# EAGLE design LinTempCont_indCh_proto (EAGLE 6.5.0)
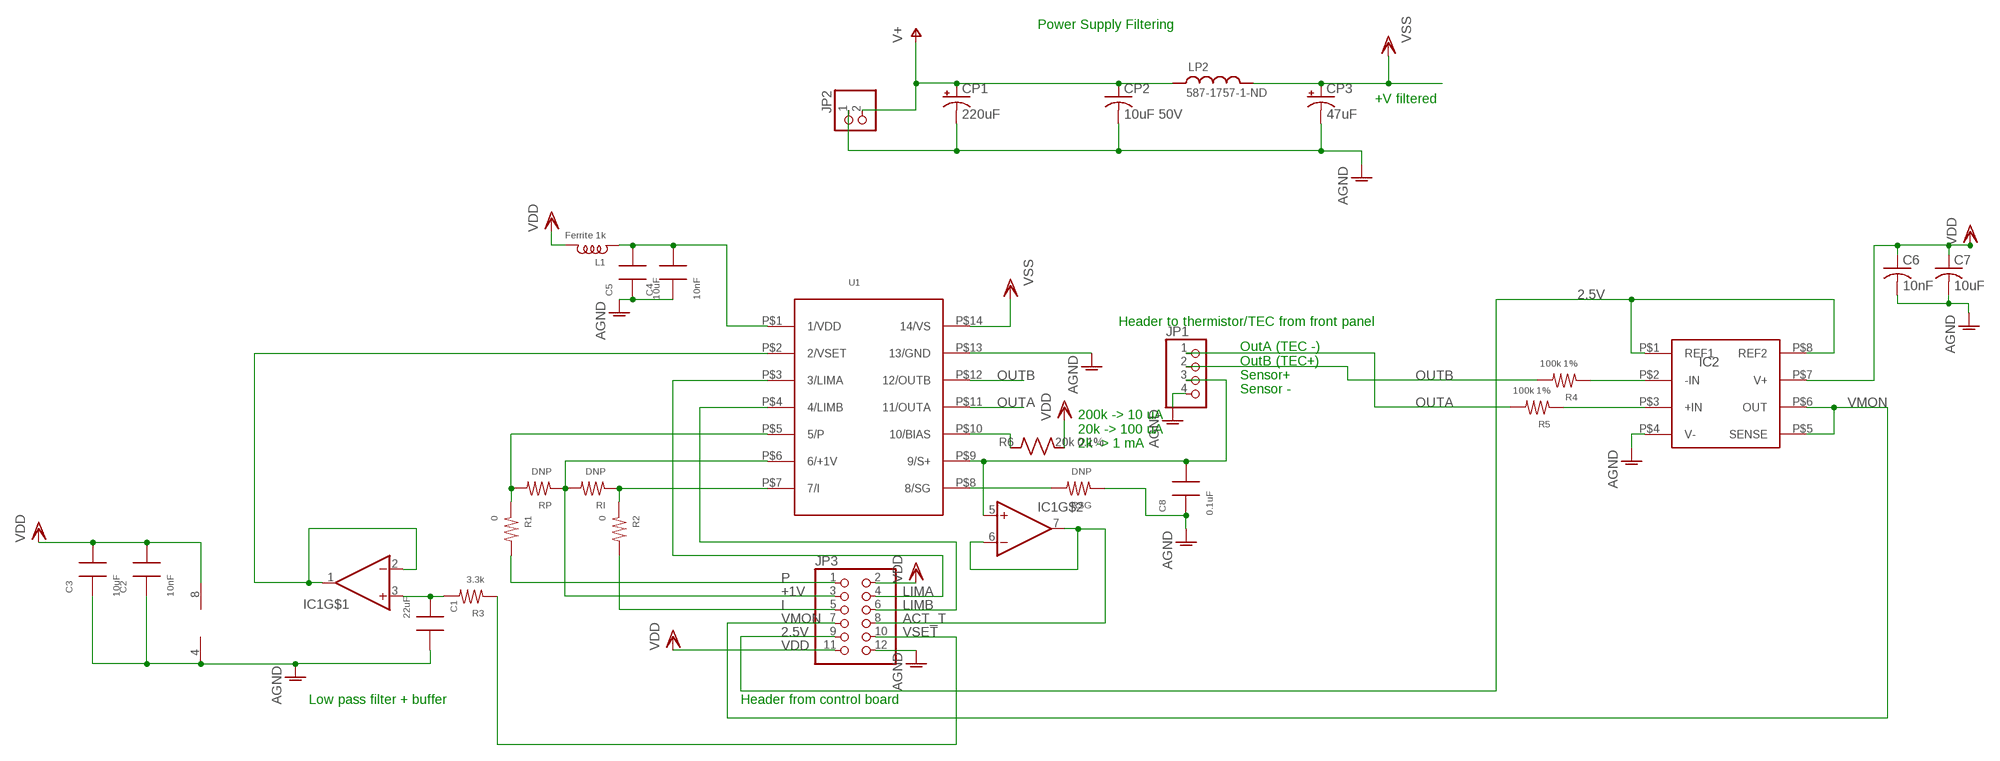
[diagram p0: schematic, sheet 1]

## Parts
C1  22uF  CAP0805  [0805]
C2  10nF  CAP0603  [0603]
C3  10uF  CAP0805  [0805]
C4  10nF  CAP0805  [0805]
C5  10uF  CAP0603  [0603]
C6  10nF  C-USC0603  [C0603]
C7  10uF  C-USC0805  [C0805]
C8  0.1uF  CAP0603  [0603]
CP1  220uF  CPOL-USF  [PANASONIC_F]
CP2  10uF 50V  C-USC1206  [C1206]
CP3  47uF  CPOL-USCT7343  [CT7343]
IC1  OP727  [TSSOP8]
IC2  INA159  [VSSOP8]
JP1  SCRWTRM-1X4/90_ED550  [1X04_RA_SCRWTRM_ED550]
JP2  SCRWTRM-1X2/90_ED550  [1X02_RA_SCRWTRM_ED550]
JP3  PINHD-2X6  [2X06]
L1  Ferrite 1k  INDUCTOR-0805  [0805]
LP2  587-1757-1-ND  L_FERRITE_SMD  [L_FERRITE_1810]
R1  0  RES0603  [0603]
R2  0  RES0603  [0603]
R3  3.3k  RES0603  [0603]
R4  100k 1%  RES0603  [0603]
R5  100k 1%  RES0603  [0603]
R6  20k 0.1%  R_SMDR0805  [R_0805]
RI  DNP  RES0603  [0603]
RP  DNP  RES0603  [0603]
RSG  DNP  RES0603  [0603]
U1  WTC3243  [WTC3293]

## Nets
2.5V: IC2.P$1(REF1) IC2.P$8(REF2) JP3.9
+1V: JP3.3 RI.2 RP.1 U1.P$6(6/+1V)
ACT_T: IC1.6(-IN) IC1.7(OUT) JP3.8
AGND: C1.2 C2.1 C3.1 C4.1 C5.1 C6.2 C7.2 C8.1 CP1.- CP2.2 CP3.- IC1.4(V-) IC2.P$4(V-) JP1.4 JP2.1 JP3.12 RSG.1 U1.P$13(13/GND)
I: JP3.5 R2.2
LIMA: JP3.4 U1.P$3(3/LIMA)
LIMB: JP3.6 U1.P$4(4/LIMB)
N$1: R1.1 RP.2 U1.P$5(5/P)
N$2: C8.2 IC1.5(+IN) JP1.3 U1.P$9(9/S+)
N$3: R2.1 RI.1 U1.P$7(7/I)
N$4: R6.P$1 U1.P$10(10/BIAS)
N$5: C1.1 IC1.3(+IN) R3.2
N$6: RSG.2 U1.P$8(8/SG)
N$7: IC1.1(OUT) IC1.2(-IN) U1.P$2(2/VSET)
N$14: IC2.P$2(-IN) R4.1
N$16: IC2.P$3(+IN) R5.1
N$26: C4.2 C5.2 L1.1 U1.P$1(1/VDD)
OUTA: JP1.1 R5.2 U1.P$11(11/OUTA)
OUTB: JP1.2 R4.2 U1.P$12(12/OUTB)
P: JP3.1 R1.2
V+: CP1.+ CP2.1 JP2.2 LP2.P$1
VDD: C2.2 C3.2 C6.1 C7.1 IC1.8(V+) IC2.P$7(V+) JP3.2 JP3.11 L1.2 R6.P$2
VMON: IC2.P$5(SENSE) IC2.P$6(OUT) JP3.7
VSET: JP3.10 R3.1
VSS: CP3.+ LP2.P$2 U1.P$14(14/VS)

## Notes on the sheet
- Power Supply Filtering
- +V filtered
- Header to thermistor/TEC from front panel
- OutA (TEC -)
  OutB (TEC+)
  Sensor+
  Sensor -
- 200k -> 10 uA
  20k -> 100 uA
  2k -> 1 mA
- Low pass filter + buffer | Header from control board

## Library data of the parts
C1-C5 C8 = rlc-jqi:CAP: SMT Capacitor
C6 C7 CP2 = rcl:C-US: CAPACITOR, American symbol
CP1 CP3 = rcl:CPOL-US: POLARIZED CAPACITOR, American symbol
IC1 = Lin-Temp-Controller:OP727: OP727 Dual Op Amp; DIGIKEY: OP727ARUZ-ND
IC2 = Lin-Temp-Controller:INA159: INA159 Difference Amplifier, Texas Instruments; DIGIKEY: 296-18688-1-ND
JP1 = Lin-Temp-Controller:SCRWTRM-1X4: Screw Terminal; DIGIKEY: ED1503-ND; MFR_PN: ED550/4DS
JP2 = Lin-Temp-Controller:SCRWTRM-1X2: Screw Terminal; DIGIKEY: ED1501-ND; MFR_PN: ED550/2DS
JP3 = pinhead:PINHD-2X6: PIN HEADER
L1 = rlc-jqi:INDUCTOR: SMT Inductor.
LP2 = jqi_passives:L_FERRITE_SMD
R1-R5 RI RP RSG = rlc-jqi:RES: SMT Resistor
R6 = jqi_passives:R_SMD
U1 = Lin-Temp-Controller:WTC3243: WTC3243 linear temp controller chip from Team Wavelength

## Board
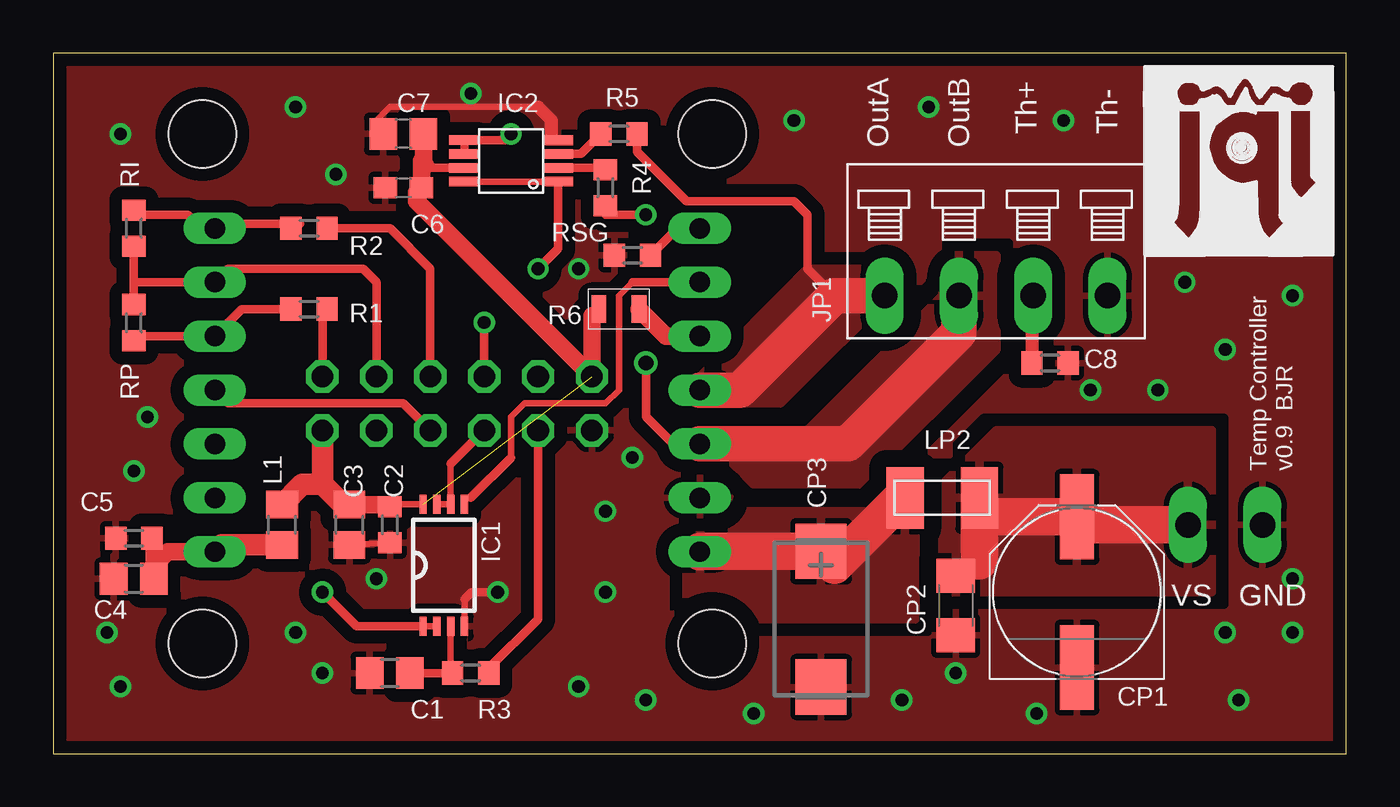
[diagram p1: board, top side]
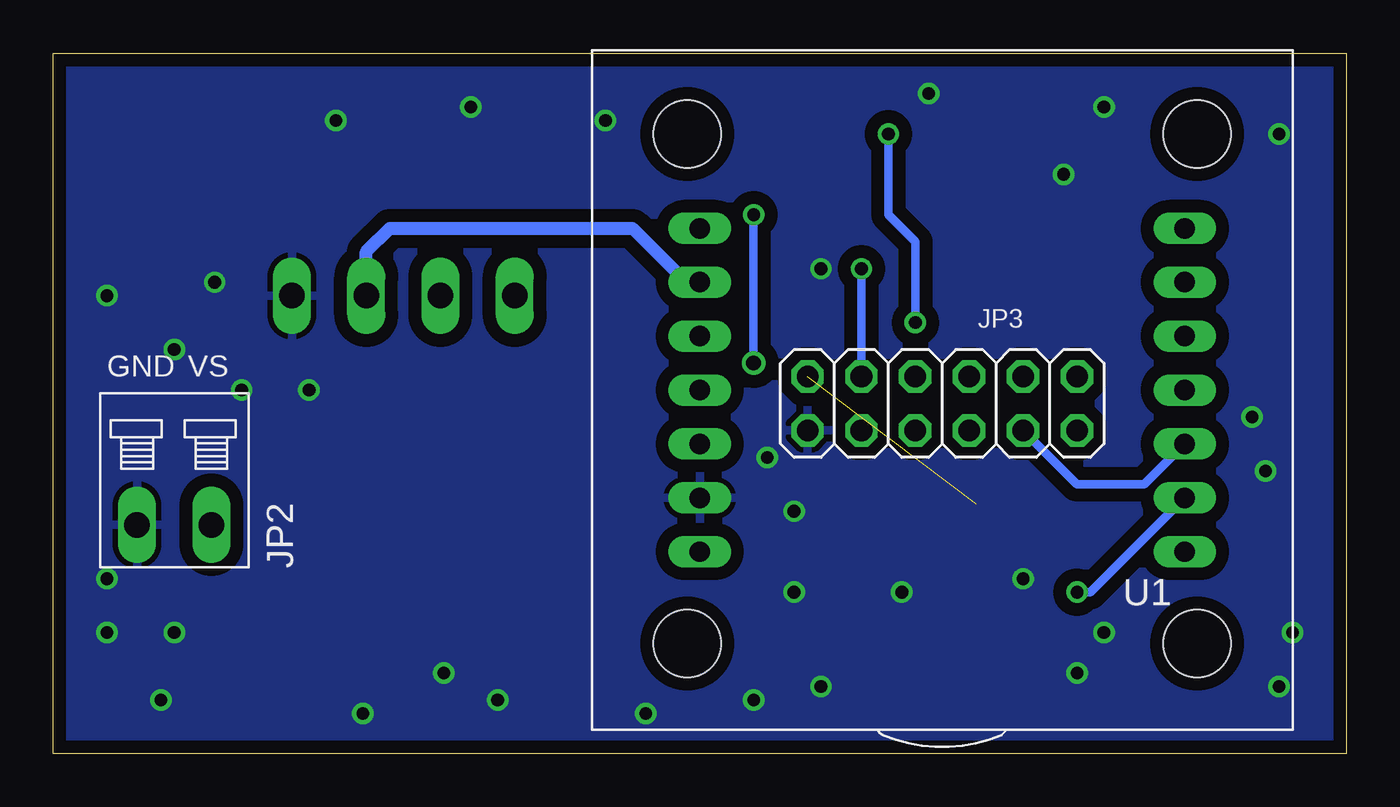
[diagram p2: board, bottom side, seen from below]

Size 60.96 x 33.02 mm. Coordinates in mm from the lower left corner, seen from the top.
Outline: 0,33.02 0,0 60.96,0 60.96,33.02 0,33.02
Copper layers (1*16): Top 0.0356mm / dielectric 1.5011mm / Bottom 0.0356mm
Design rules "SilverCircuits": minimum track width 7mil, minimum drill 14mil, track to track 7mil, track to pad 7mil, pad to pad 7mil, via to via 7mil, smd to smd 0mil, copper to edge 20mil, drill to drill 8mil, minimum pad ring 10mil, minimum via ring 8mil, stop-mask expansion 4mil, vias tented up to drill 0mil, thermal gap 10mil

### Footprints (pad centres in the part's own frame; a part is rotated, then mirrored left to right if it is on the bottom)
0805 = smd 1.3 x 1.5: 1 -0.95,0; 2 0.95,0
0603 = smd 1 x 1.1: 1 -0.85,0; 2 0.85,0
C0603 = smd 1.1 x 1: 1 -0.85,0; 2 0.85,0
C0805 = smd 1.3 x 1.5: 1 -0.95,0; 2 0.95,0
PANASONIC_F = smd 4 x 1.6: + 3.55,0; - -3.55,0
C1206 = smd 1.6 x 1.8: 1 -1.4,0; 2 1.4,0
CT7343 = smd 2.6 x 2.4: + -3.2,0; - 3.2,0
TSSOP8 = smd 0.9 x 0.35: 1 -2.875,0.975; 2 -2.875,0.325; 3 -2.875,-0.325; 4 -2.875,-0.975; 5 2.875,-0.975; 6 2.875,-0.325; 7 2.875,0.325; 8 2.875,0.975
VSSOP8 = smd 0.45 x 1.45: P$1 -0.975,-2.2; P$2 -0.325,-2.2; P$3 0.325,-2.2; P$4 0.972,-2.2; P$5 0.975,2.2; P$6 0.325,2.2; P$7 -0.325,2.2; P$8 -0.975,2.2
1X04_RA_SCRWTRM_ED550 = drill 1.2 long: 1 -5.25,0; 2 -1.75,0; 3 1.75,0; 4 5.25,0
1X02_RA_SCRWTRM_ED550 = drill 1.2 long: 1 -1.75,0; 2 1.75,0
2X06 = drill 1.016 octagon: 1 -6.35,-1.27; 2 -6.35,1.27; 3 -3.81,-1.27; 4 -3.81,1.27; 5 -1.27,-1.27; 6 -1.27,1.27; 7 1.27,-1.27; 8 1.27,1.27; 9 3.81,-1.27; 10 3.81,1.27; 11 6.35,-1.27; 12 6.35,1.27
L_FERRITE_1810 = smd 1.75 x 2.9: P$1 -1.75,0; P$2 1.75,0
R_0805 = smd 0.7 x 1.3: P$1 -0.95,0; P$2 0.95,0
WTC3293 = drill 0.965 long: P$1 -11.43,7.62; P$2 -11.43,5.08; P$3 -11.43,2.54; P$4 -11.43,0; P$5 -11.43,-2.54; P$6 -11.43,-5.08; P$7 -11.43,-7.62; P$8 11.43,-7.62; P$9 11.43,-5.08; P$10 11.43,-2.54; P$11 11.43,0; P$12 11.43,2.54; P$13 11.43,5.08; P$14 11.43,7.62 | hole 3.175: -12.014,11.938; 12.014,11.938; 12.014,-12.065; -12.014,-12.065

### Placement (x,y rotation side)
C1  15.88,3.81 180 top
C2  15.88,10.79 90 top
C3  13.97,10.79 90 top
C4  3.81,8.26 0 top
C5  3.81,10.16 0 top
C6  16.51,26.67 180 top
C7  16.51,29.21 180 top
C8  46.99,18.41 180 top
CP1  48.26,7.62 90 top
CP2  42.55,6.99 270 top
CP3  36.2,6.35 270 top
IC1  18.41,8.89 90 top
IC2  21.59,27.94 90 top
JP1  44.45,21.59 0 top
JP2  55.24,10.79 0 bottom
JP3  19.05,16.51 180 bottom
L1  10.79,10.79 90 top
LP2  41.91,12.06 180 top
R1  12.06,20.95 0 top
R2  12.06,24.77 0 top
R3  19.68,3.81 180 top
R4  26.04,26.67 270 top
R5  26.67,29.21 0 top
R6  26.67,20.95 180 top
RI  3.81,24.77 270 top
RP  3.81,20.32 270 top
RSG  27.3,23.5 0 top
U1  19.05,17.14 180 bottom
U$1  [JQI_LOGO_NEGATIVE-SILKSCREEN]  51.44,23.5 0 top

### Tracks (layer width: path | path; a pad name or v marks a point on that pad's centre or on a via)
2.5V  (via drill 0.6)
  Top 0.305: IC2.P$1 IC2.P$8
  Top 0.406: IC2.P$1 23.79,23.79 v22.86,22.86
  Bottom 0.406: JP3.9 v22.86,22.86
+1V
  Top 0.406: JP3.3 15.24,22.23 14.61,22.86 8.26,22.86 U1.P$6 3.81,22.23 | RI.2 3.81,22.23 | 3.81,22.23 RP.1
ACT_T
  Top 0.305: IC1.7 IC1.6 18.74,13.66
  Top 0.406: 18.74,13.66 JP3.8
AGND  (via drill 0.6)
  Top 0.305: C2.1 C3.1 | 22.86,30.48 15.88,30.48 15.24,29.84 15.24,29.63 C7.2 | IC1.4 19.39,7.28 | IC2.P$4 23.5,29.21
  Top 0.406: v20.95,7.62 19.73,7.62 19.39,7.28
  Top 0.61: 23.5,29.21 23.5,29.84 22.86,30.48
  other vias: 26.04,7.62 26.04,11.43 27.3,13.97 3.17,29.21 4.45,15.88 3.81,13.34 12.7,3.81 3.17,3.17 24.77,3.17 27.94,2.54 33.02,1.91 42.55,3.81 40.01,2.54 46.35,1.91 55.24,5.71 55.88,2.54 58.42,8.26 47.62,29.84 53.34,22.23 48.9,17.14 58.42,21.59 41.27,30.48 34.92,29.84 11.43,30.48 13.34,27.3 19.68,31.11 11.43,5.71 55.24,19.05 52.07,17.14 15.24,8.26 24.77,22.86 2.54,5.71 58.42,5.71
  pour Bottom (isolate 0.61): -3.81,36.83 -3.81,-2.54 63.5,-2.54 63.5,36.83
  pour Top (isolate 0.61, rank 6): -2.54,34.29 -2.54,-2.54 63.5,-2.54 63.5,35.56 -2.54,35.56
I
  Top 0.406: JP3.5 17.78,22.86 15.88,24.77 R2.2
LIMA
  Bottom 0.406: JP3.4 12.7,12.7 9.53,12.7 U1.P$3
LIMB
  Top 0.406: JP3.6 16.51,16.51 8.26,16.51 U1.P$4
N$1
  Top 0.406: 8.04,20.11 U1.P$5 | R1.1 8.89,20.95 U1.P$5 | U1.P$5 4.12,19.68 RP.2
N$2
  Top 0.305: 27.3,22.23 26.67,21.59 26.67,17.14 26.04,16.51 22.23,16.51 21.59,15.88 21.59,13.96 | 19.68,12.06 19.39,12.06 IC1.5
  Top 0.406: U1.P$9 27.3,22.23 | 21.59,13.96 19.68,12.06
  Top 0.61: JP1.3 46.14,21.59 C8.2
  Bottom 0.61: U1.P$9 31.11,22.23 33.66,24.77 45.09,24.77 46.2,23.65 JP1.3
N$3
  Top 0.406: R2.1 11.63,24.98 7.83,24.98 U1.P$7 6.99,24.77 6.35,25.4 4.12,25.4 RI.1
N$4
  Top 0.813: U1.P$10 28.89,19.68 R6.P$1
N$5
  Top 0.305: R3.2 18.74,3.9 IC1.3
  Top 0.406: C1.1 R3.2
N$6
  Top 0.406: U1.P$8 29.43,24.77 RSG.2
N$7  (via drill 0.6)
  Top 0.305: IC1.2 IC1.1
  Top 0.406: IC1.1 14.3,6.01 v12.7,7.62
  Bottom 0.406: v12.7,7.62 12.06,7.62 U1.P$2
N$14
  Top 0.305: 25.94,27.61 R4.1
  Top 0.406: IC2.P$2 25.94,27.61
N$16
  Top 0.406: IC2.P$3 24.88,28.27 R5.1
N$26
  Top 0.813: C4.2 4.76,8.89 | 4.76,8.89 4.76,10.06 C5.2 | U1.P$1 5.39,9.53 4.76,8.89
  Top 1.016: L1.1 7.94,9.85 U1.P$1
OUTA
  Top 0.406: R5.2 27.52,28.36 29.84,26.04 34.92,26.04 35.56,25.4 35.56,22.86 36.83,21.59
  Top 1.676: U1.P$11 32.38,17.14 36.83,21.59 JP1.1
  pour Top (isolate 0.61, rank 2): 30.48,16.51 30.48,17.78 35.56,22.86 40.01,22.86 40.01,22.23 34.29,16.51
OUTB  (via drill 0.6, 0.7)
  Top 0.305: R4.2 26.04,25.4
  Top 0.406: 26.04,25.4 v27.94,25.4 | v27.94,18.41 27.94,15.88 29.21,14.61 U1.P$12
  Top 1.676: JP1.2 42.7,19.84 37.47,14.61 U1.P$12
  Bottom 0.406: v27.94,25.4 v27.94,18.41
  pour Top (isolate 0.813, rank 3): 30.48,13.97 31.75,13.97 33.02,12.7 38.1,12.7 44.45,19.05 44.45,23.5 41.91,23.5 41.91,21.59 35.56,15.24 30.48,15.24
P
  Top 0.406: JP3.1 12.7,20.64 R1.2
V+
  Top 1.016: 48.63,10.79 CP1.+ | 44.55,11.17 LP2.P$1 | 43.66,9.1 CP2.1
  Top 1.778: JP2.2 49.91,10.79 48.63,10.79 | CP1.+ 44.55,11.17 | LP2.P$1 43.66,9.1
  pour Top (isolate 0.813, rank 4): 54.61,15.24 54.61,7.62 41.91,7.62 41.91,12.7 44.45,15.24
VDD  (1 unrouted)
  Top 0.305: IC1.8 15.88,11.77 C2.2
  Top 0.406: IC2.P$7 17.68,27.61 17.57,27.73 17.36,27.94
  Top 0.61: 25.4,20.64 R6.P$2
  Top 0.813: 17.36,27.94 C6.1 17.14,26.45 17.14,26.04 JP3.11 25.4,20.64 | C7.1 17.46,27.84 17.57,27.73 | C3.2 15.78,11.74 C2.2
  Top 1.016: JP3.2 12.7,12.7 | C3.2 13.76,11.64 12.7,12.7 | 12.7,12.7 11.75,12.7 L1.2
VMON  (via drill 0.6)
  Top 0.406: IC2.P$6 IC2.P$5 21.3,28.91 v21.59,29.21 | JP3.7 v20.32,20.32
  Bottom 0.406: v20.32,20.32 20.32,24.13 21.59,25.4 v21.59,29.21
VSET
  Top 0.406: R3.1 20.54,4.03 22.86,6.35 JP3.10
VSS
  Top 1.016: LP2.P$2 40.01,12.06 | 36.83,8.89 36.83,8.91 CP3.+
  Top 1.778: 36.22,9.53 CP3.+ 30.5,9.55 U1.P$14 | 40.01,12.06 36.83,8.89
  pour Top (isolate 0.813, rank 5): 40.64,11.43 40.64,6.35 29.84,6.35 29.84,11.43

### Text on the board
tPlace: OutA | OutB | Th+ | Th- | Temp Controller / v0.9 BJR | VS | GND
bPlace: VS | GND